# Altium project AdjustableSupplyPower.PrjPcb
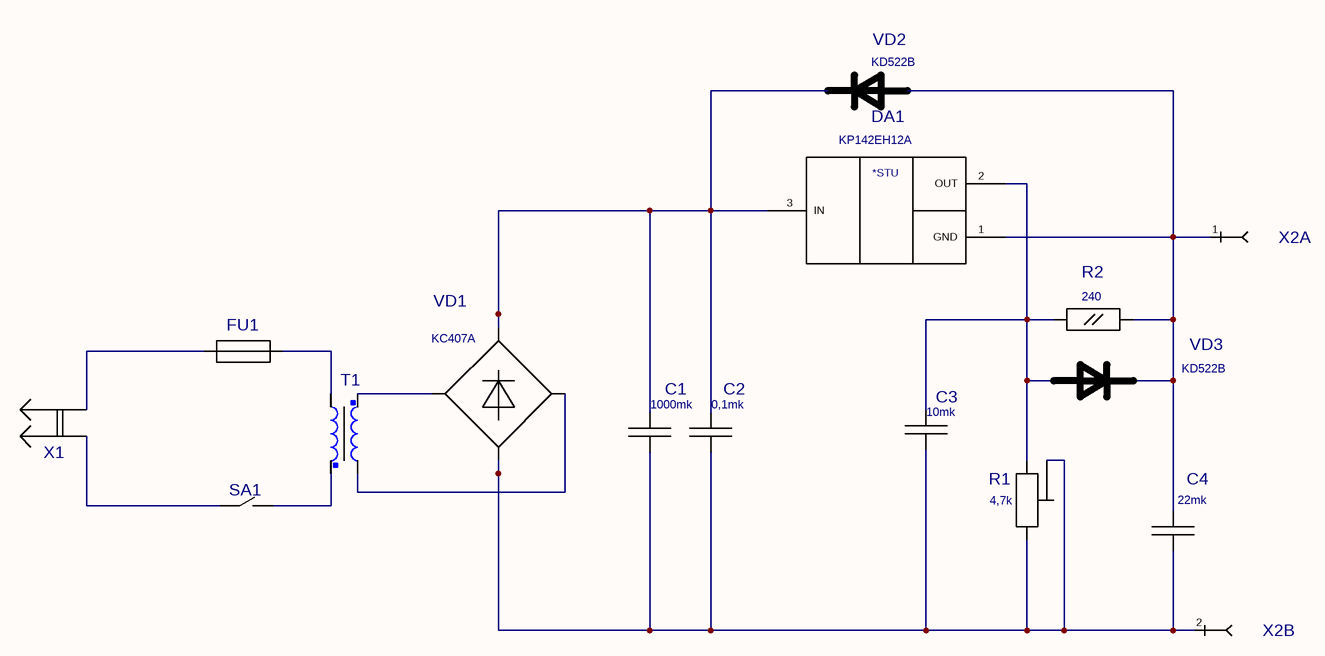
[diagram p0: Sheet1.SCHDOC]
1 sheet, 15 parts. Net scope: global (net labels, ports and power ports of the same name join across sheets).
Board file: AdjustableSupplyPower.PcbDoc

## Sheet Sheet1.SCHDOC
size 297 x 209 mm; SheetNumber: 1; SheetTotal: 1; DocumentName: Sheet1.SCHDOC

### Parts
C1  value 1000mk  [1017-B3R]  (hidden comment: 1017-B3R)
C2  value 0,1mk  [1017-B3R]  (hidden comment: 1017-B3R)
C3  value 10mk  [1017-B3R]  (hidden comment: 1017-B3R)
C4  value 22mk  [1017-B3R]  (hidden comment: 1017-B3R)
DA1  value KP142EH12A  [TO-220-KT-28-2]  (hidden comment: КР142ЕН12А)
FU1  FH-101C  [FH-101C]  (value not drawn)
R1  value 4,7k  [SP5-16-025]  (hidden comment: СП5-16-0,25)
R2  value 240  [C2-33H-0.125W]  (hidden comment: C2-33H-0.125W_OLD_UGO)
SA1  8AS9M2RE  [8AS9M2RE]  (value not drawn)
T1  ДФПК30-2/Х  [ДФПК30-2/Х]  (value not drawn)
VD1  value KC407A  [KC407]  (hidden comment: KC407)
VD2  value KD522B  [КД521(522)]  (hidden comment: КД522Б)
VD3  value KD522B  [КД521(522)]  (hidden comment: КД522Б)
X1  2XR  [2XR]  (value not drawn)
X2  30FMN  [30FMN]  (value not drawn)  (parts A,B of 30)

### Nets
NetC1_1: C1.1(I/OA) C2.1(I/OA) DA1.3(IN) VD1.3(I/O3) VD1.4(I/O4) VD2.2(K)
NetC1_2: C1.2(I/OB) C2.2(I/OB) C3.2(I/OB) C4.2(I/OB) R1.1 R1.3 VD1.1(I/O1) VD1.6(I/O6) X2.2(i/o)
NetC3_1: C3.1(I/OA) DA1.2(OUT) R1.2 R2.1 VD3.1(A)
NetC4_1: C4.1(I/OA) DA1.1(GND) R2.2 VD2.1(A) VD3.2(K) X2.1(i/o)
NetFU1_1: FU1.1 X1.2(I/O2)
NetFU1_2: FU1.2 T1.2
NetSA1_1: SA1.1 T1.1
NetSA1_2: SA1.2 X1.1(I/O1)
NetT1_3: T1.3 VD1.5(I/O5)
NetT1_4: T1.4 VD1.2(I/O2)

Not connected (* = marked no-connect by the designer): DA1 4

### Notes on the sheet
- (in symbol КР142ЕН12А) *STU

### Library data of the parts
C1-C4 = 1017-B3R: PDIF_TY: 11201
R2 = C2-33H-0.125W_OLD_UGO: Autor: pcbdesigner.ru
FU1 = FH-101C: Value: *
SA1 = 8AS9M2RE: Value: *; Author: pcbdesigner.ru
T1 = ДФПК30-2/Х: Author: pcbdesigner.ru
X1 = 2XR: Value: *
X2 = 30FMN: Value: *